# EAGLE design MEMS-preamp_v14 (EAGLE 8.5.0)

## Sheet 1 of 2
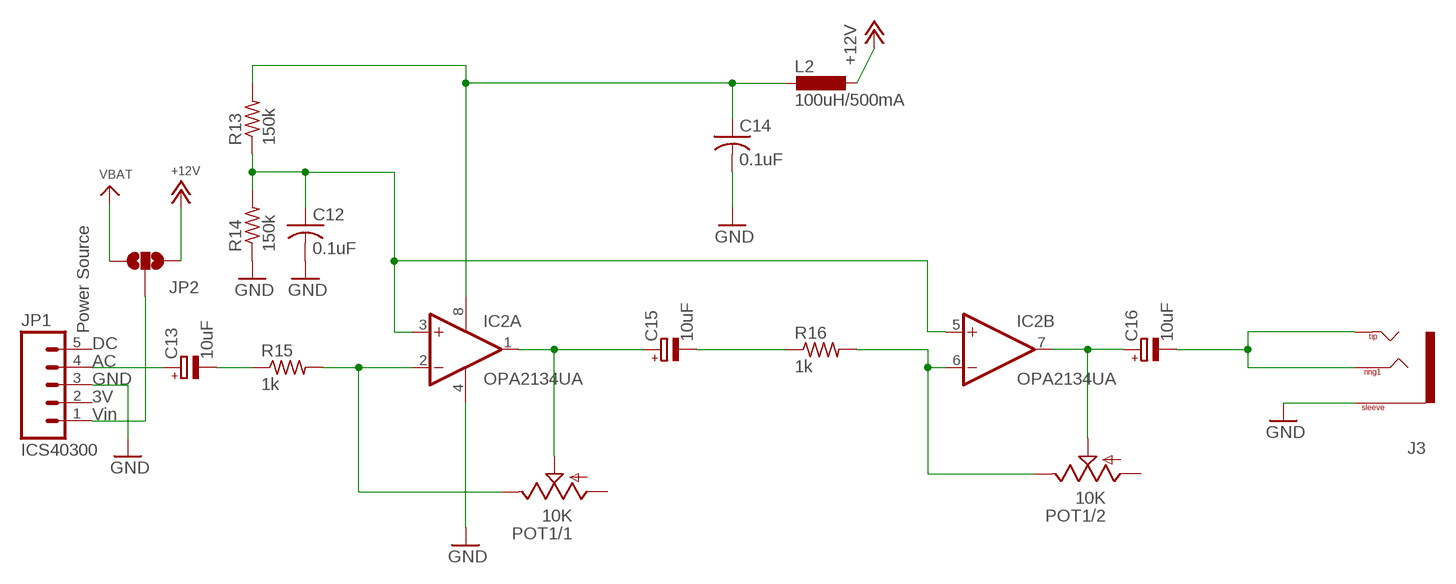
[diagram p0: schematic, sheet 1]

### Parts
C12  0.1uF  C-USC0805  [C0805]
C13  10uF  CPOL-EUB  [PANASONIC_B]
C14  0.1uF  C-USC0805K  [C0805K]
C15  10uF  CPOL-EUB  [PANASONIC_B]
C16  10uF  CPOL-EUB  [PANASONIC_B]
IC2  OPA2134UA  [SO08]
J3  TRS-1/8"-3.5MM  [TRS_SJ-3524-SMT]
JP1  ICS40300  M05SMD_2.54MM  [1X05_SMD_STRAIGHT]
JP2  Power Source  JUMPER-SMT_3_NO_SILK  [SMT-JUMPER_3_NO_SILK]
L2  100uH/500mA  L-EUL3225M  [L3225M]
POT1  10K  POT-DUAL-PTV112-4420  [PTV112]
R13  150k  R-US_R0603  [R0603]
R14  150k  R-US_R0603  [R0603]
R15  1k  R-US_R0603  [R0603]
R16  1k  R-US_R0603  [R0603]

### Nets
+12V [audio]: JP2.3 L2.1 ; also sheet 2
GND [audio]: C12.2 C14.2 IC2.4(A:V-) J3.1(SLEEVE) JP1.3 R14.1 ; also sheet 2
N$3 [audio]: C13.+ JP1.4
N$4 [audio]: C15.- R16.1
N$5 [audio]: IC2.2(A:-IN) POT1.1.3(/1:E) R15.2
N$7 [audio]: C16.- J3.2(TIP) J3.3(RING1) J3.4(TIP)
N$8 [audio]: C12.1 IC2.3(A:+IN) IC2.5(B:+IN) R13.1 R14.2
N$9 [audio]: C15.+ IC2.1(A:OUT) POT1.1.2(/1:S)
N$10 [audio]: C16.+ IC2.7(B:OUT) POT1.2.2(/2:S)
N$15 [audio]: C14.1 IC2.8(A:V+) L2.2 R13.2
N$21 [audio]: IC2.6(B:-IN) POT1.2.3(/2:E) R16.2
N$23 [audio]: C13.- R15.1
VBAT [audio]: JP2.1 ; also sheet 2
VIN [audio]: JP1.1 JP2.2
Unconnected: JP1.2 JP1.5 POT1.1.1(/1:A) POT1.2.1(/2:A)

## Sheet 2 of 2
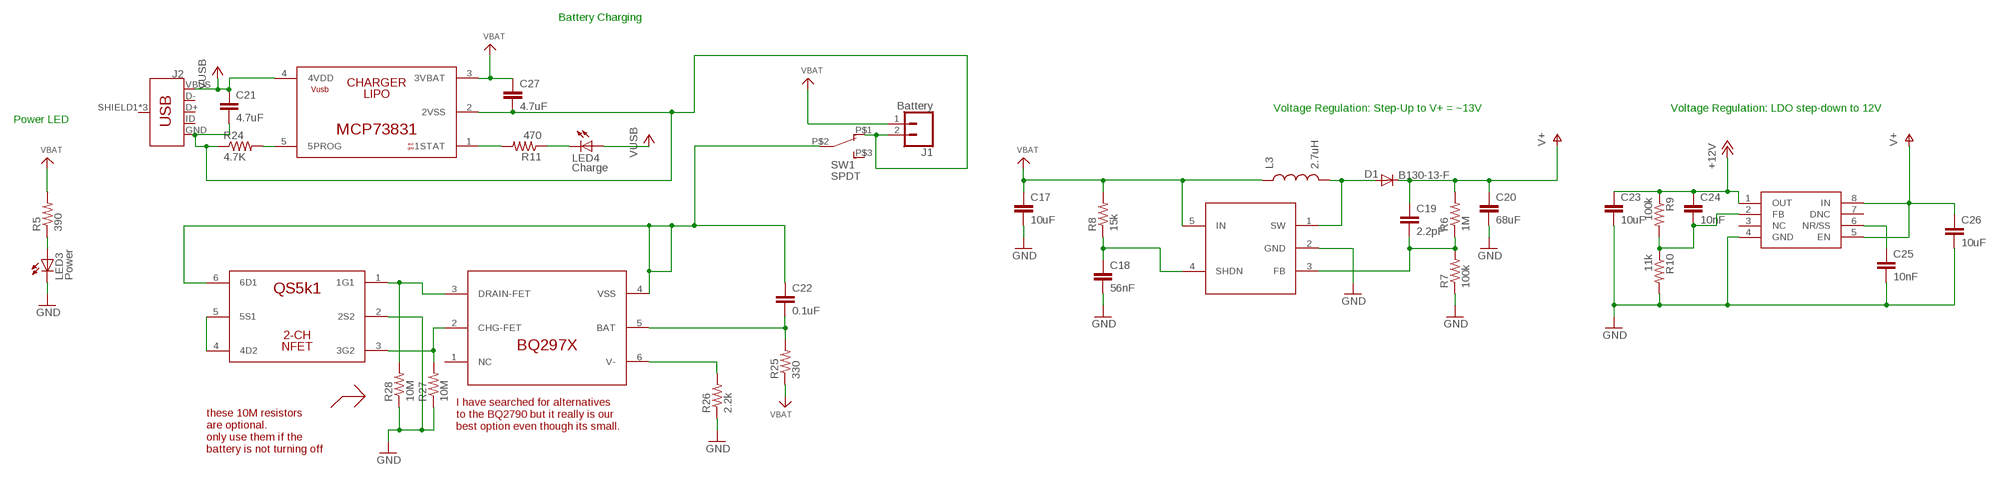
[diagram p1: schematic, sheet 2]

### Parts
C17  10uF  C-EUC0603  [C0603]
C18  56nF  C-EUC0603  [C0603]
C19  2.2pF  C-EUC0603  [C0603]
C20  68uF  C-EUC1206  [C1206]
C21  4.7uF  C-EUC0603  [C0603]
C22  0.1uF  C-EUC0603  [C0603]
C23  10uF  C-EUC0603  [C0603]
C24  10nF  C-EUC0603  [C0603]
C25  10nF  C-EUC0603  [C0603]
C26  10uF  C-EUC0603  [C0603]
C27  4.7uF  C-EUC0603  [C0603]
D1  B130-13-F  DIODESMA  [SMA-DIODE]
IC7  TPS7A49  [MSOP-8]
IC8  BQ297X  BQ297X-BATTERY-MANAGERLONG  [WSON-6-LONG]
IC9  SC4503  [SOT23-5]
IC10  MCP73831  [SOT-23-5]
IC11  QS6K1  [SOT457R_PHILIPS]
J1  Battery  CONN_02LOCK  [1X02_LOCK]
J2  USB_MICRO-BREDUCED_PASTE  [USB-B-MICRO-SMD_RED_PASTE]
L3  2.7uH  INDUCTORCR54  [CR54]
LED3  Power  LED3MM  [LED3MM]
LED4  Charge  LED3MM  [LED3MM]
R5  390  R-US_R0603  [R0603]
R6  1M  R-US_R0603  [R0603]
R7  100k  R-US_R0603  [R0603]
R8  15k  R-US_R0603  [R0603]
R9  100k  R-US_R0603  [R0603]
R10  11k  R-US_R0603  [R0603]
R11  470  R-US_R0603  [R0603]
R24  4.7K  R-US_R0603  [R0603]
R25  330  R-US_R0603  [R0603]
R26  2.2k  R-US_R0603  [R0603]
R27  10M  R-US_R0603  [R0603]
R28  10M  R-US_R0603  [R0603]
SW1  SPDT  SWITCH_SPDTCL-SB-12B  [SWITCH_SPDT_CL-SB-12B]

### Nets
+5V: C21.1 IC10.4(4VDD) J2.VBUS LED4.A ; supply symbol labelled VUSB
+12V [audio]: C23.1 C24.1 IC7.1(OUT) R9.1 ; also sheet 1
BATGND1: C22.1 IC8.4(VSS) IC11.6(6D1) SW1.P$2
GND [audio]: C17.2 C18.2 C20.2 C23.2 C25.2 C26.2 IC7.4(GND) IC9.2(GND) IC11.2(2S2) LED3.K(C) R7.1 R10.2 R26.1 R27.1 R28.1 ; also sheet 1
N$6: LED3.A R5.1
N$11: D1.A IC9.1(SW) L3.P$2
N$12: C18.1 IC9.4(SHDN) R8.1
N$13: C19.2 IC9.3(FB) R6.1 R7.2
N$14: C24.2 IC7.2(FB) R9.2 R10.1
N$16: C25.1 IC7.6(NR/SS)
N$17: LED4.K(C) R11.1
N$19: C22.2 IC8.5(BAT) R25.2
N$20: IC10.5(5PROG) R24.2
N$24: IC10.1(1STAT) R11.2
N$33: IC11.4(4D2) IC11.5(5S1)
N$35: IC8.3(DRAIN-FET) IC11.1(1G1) R28.2
N$36: IC8.2(CHG-FET) IC11.3(3G2) R27.2
N$37: IC8.6(V-) R26.2
USBGND1: C21.2 C27.2 IC10.2(2VSS) J1.2 J2.GND R24.1 SW1.P$1
V+: C19.1 C20.1 C26.1 D1.C IC7.5(EN) IC7.8(IN) R6.2
VBAT [audio]: C17.1 C27.1 IC9.5(IN) IC10.3(3VBAT) J1.1 L3.P$1 R5.2 R8.2 R25.1 ; also sheet 1
Unconnected: IC7.3(NC) IC7.7(DNC) IC8.1(NC) J2.D+ J2.D- J2.ID J2.SHIELD1(SHIELD) J2.SHIELD2(SHIELD) J2.SHIELD3(SHIELD) SW1.P$3

### Notes on the sheet
- Battery Charging
- Voltage Regulation: Step-Up to V+ = ~13V | Voltage Regulation: LDO step-down to 12V
- Power LED
- I have searched for alternatives 
  to the BQ2790 but it really is our 
  best option even though its small.
- these 10M resistors
  are optional. 
  only use them if the 
  battery is not turning off

## Library data of the parts
C12 C14 = adafruit:C-US: CAPACITOR, American symbol
C13 C15 C16 = CMU-ArtFab:CPOL-EU: POLARIZED CAPACITOR, European symbol
C17-C27 = rcl:C-EU: CAPACITOR, European symbol; SPICEPREFIX: C
D1 = SparkFun:DIODE: Diode These are standard reverse protection diodes and small signal diodes. SMA package can handle up to about 1A. SOD-323 can handle about 200mA. What the SOD-323 package when ordering, there are some mfgs out there that are 5-pin packages.
IC2 = linear:OPA2*: Dual Operational Amplifier Low Power, Single-Supply, Rail-To-Rail Operational Amplifier Source: http://focus.ti.com/lit/ds/symlink/opa2345.pdf http://focus.ti.com .. opa241.pdf http://focus.ti.com/lit/ds/symlink/opa2134.pdf
IC7 = CMU-ArtFab:TPS7A49
IC8 = CMU-ArtFab:BQ297X-BATTERY-MANAGER
IC9 = CMU-ArtFab:SC4503
IC10 = CMU-ArtFab:MCP73831
IC11 = CMU-ArtFab:QS6K1
J1 = SparkFun-Connectors:CONN_02: Multi connection point. Often used as Generic Header-pin footprint for 0.1 inch spaced/style header connections On any of the 0.1 inch spaced packages, you can populate with these: Break Away Headers - Straight <https://www.sparkfun.com/products/116> (PRT-00116) Break Away Male Headers - Right Angle <https://www.sparkfun.com/products/553> (PRT-00553) Female Headers <https://www.sparkfun.com/products/115> (PRT-00115) Break Away Headers - Machine Pin <https://www.sparkfun.com/products/117> (PRT-00117) Break Away Female Headers - Swiss Machine Pin <https://www.sparkfun.com/products/743> (PRT-00743) For SCREWTERMINALS and SPRING TERMINALS visit here: Screw Terimnals on SparkFun.com <https://www.sparkfun.com/search/results?term=Screw+Terminals> (5mm/3.5mm/2.54mm spacing) This device is also useful as a general connection point to wire up your design to another part of your project. Our various solder wires solder well into these plated through hole pads. Hook-Up Wire - Assortment (Stranded, 22 AWG) <https://www.sparkfun.com/products/11375> (PRT-11375) Hook-Up Wire - Assortment (Solid Core, 22 AWG) <https://www.sparkfun.com/products/11367> (PRT-11367) View the entire wire category on our website here <https://www.sparkfun.com/categories/141> Special notes: Molex polarized connector foot print use with: PRT-08233 with associated crimp pins and housings. 2.54_SCREWTERM for use with PRT-10571. 3.5mm Screw Terminal footprints for PRT-08084 5mm Screw Terminal footprints for use with PRT-08432
J2 = CMU-ArtFab:USB_MICRO-B: USB Type Micro-B Connector Male/female and PTH/SMT variants SparkFun Products: SparkFun microB USB Breakout <https://www.sparkfun.com/products/12035> SparkFun USB microB Plug Breakout <https://www.sparkfun.com/products/10031> SparkFun ESP8266 Thing <https://www.sparkfun.com/products/13231>; PROD_ID: CONN-11752
J3 = CMU-ArtFab:TRS-1/8"-3.5MM
JP1 = CMU-ArtFab:M05: Multi connection point. Often used as Generic Header-pin footprint for 0.1 inch spaced/style header connections On any of the 0.1 inch spaced packages, you can populate with these: Break Away Headers - Straight <https://www.sparkfun.com/products/116> (PRT-00116) Break Away Male Headers - Right Angle <https://www.sparkfun.com/products/553> (PRT-00553) Female Headers <https://www.sparkfun.com/products/115> (PRT-00115) Break Away Headers - Machine Pin <https://www.sparkfun.com/products/117> (PRT-00117) Break Away Female Headers - Swiss Machine Pin <https://www.sparkfun.com/products/743> (PRT-00743) For SCREWTERMINALS and SPRING TERMINALS visit here: Screw Terimnals on SparkFun.com <https://www.sparkfun.com/search/results?term=Screw+Terminals> (5mm/3.5mm/2.54mm spacing) This device is also useful as a general connection point to wire up your design to another part of your project. Our various solder wires solder well into these plated through hole pads. Hook-Up Wire - Assortment (Stranded, 22 AWG) <https://www.sparkfun.com/products/11375> (PRT-11375) Hook-Up Wire - Assortment (Solid Core, 22 AWG) <https://www.sparkfun.com/products/11367> (PRT-11367) View the entire wire category on our website here <https://www.sparkfun.com/categories/141> Special notes: Molex polarized connector foot print use with SKU : PRT-08231 with associated crimp pins and housings. 1MM SMD Version SKU: PRT-10208; CON1: Vin; CON2: 3V; CON3: GND; CON4: AC; CON5: DC
JP2 = SparkFun-Jumpers:JUMPER-SMT_3_NO: Normally open jumper This jumper has three pads in close proximity to each other. Apply solder to close the connection(s).
L2 = rcl:L-EU: INDUCTOR, European symbol; SPICEPREFIX: L
L3 = SparkFun-Passives:INDUCTOR: Inductors Basic Inductor/Choke - 0603 and 1206. Footprints are not proven and vary greatly between part numbers. SRN6045- 33uH, 20% 1.4A SDR0403-560KL - 56uH, 10%, 500mA RMS/740mA peak
LED3 LED4 = led:LED: LED OSRAM: - CHIPLED LG R971, LG N971, LY N971, LG Q971, LY Q971, LO R971, LY R971 LH N974, LH R974 LS Q976, LO Q976, LY Q976 LO Q996 - Hyper CHIPLED LW Q18S LB Q993, LB Q99A, LB R99A - SideLED LS A670, LO A670, LY A670, LG A670, LP A670 LB A673, LV A673, LT A673, LW A673 LH A674 LY A675 LS A676, LA A676, LO A676, LY A676, LW A676 LS A679, LY A679, LG A679 - Hyper Micro SIDELED® LS Y876, LA Y876, LO Y876, LY Y876 LT Y87S - SmartLED LW L88C, LW L88S LB L89C, LB L89S, LG L890 LS L89K, LO L89K, LY L89K LS L896, LA L896, LO L896, LY L896 - TOPLED LS T670, LO T670, LY T670, LG T670, LP T670 LSG T670, LSP T670, LSY T670, LOP T670, LYG T670 LG T671, LOG T671, LSG T671 LB T673, LV T673, LT T673, LW T673 LH T674 LS T676, LA T676, LO T676, LY T676, LB T676, LH T676, LSB T676, LW T676 LB T67C, LV T67C, LT T67C, LS T67K, LO T67K, LY T67K, LW E67C LS E67B, LA E67B, LO E67B, LY E67B, LB E67C, LV E67C, LT E67C LW T67C LS T679, LY T679, LG T679 LS T770, LO T770, LY T770, LG T770, LP T770 LB T773, LV T773, LT T773, LW T773 LH T774 LS E675, LA E675, LY E675, LS T675 LS T776, LA T776, LO T776, LY T776, LB T776 LHGB T686 LT T68C, LB T68C - Hyper Mini TOPLED® LB M676 - Mini TOPLED Santana® LG M470 LS M47K, LO M47K, LY M47K Source: http://www.osram.convergy.de LUXEON: - LUMILED® LXK2-PW12-R00, LXK2-PW12-S00, LXK2-PW14-U00, LXK2-PW14-V00 LXK2-PM12-R00, LXK2-PM12-S00, LXK2-PM14-U00 LXK2-PE12-Q00, LXK2-PE12-R00, LXK2-PE12-S00, LXK2-PE14-T00, LXK2-PE14-U00 LXK2-PB12-K00, LXK2-PB12-L00, LXK2-PB12-M00, LXK2-PB14-N00, LXK2-PB14-P00, LXK2-PB14-Q00 LXK2-PR12-L00, LXK2-PR12-M00, LXK2-PR14-Q00, LXK2-PR14-R00 LXK2-PD12-Q00, LXK2-PD12-R00, LXK2-PD12-S00 LXK2-PH12-R00, LXK2-PH12-S00 LXK2-PL12-P00, LXK2-PL12-Q00, LXK2-PL12-R00 Source: www.luxeon.com KINGBRIGHT: KA-3528ASYC Source: www.kingbright.com
POT1 = CMU-ArtFab:POT-DUAL-PTV112: Bourns 11mm dual potentiometer; AVAILABILITY: Unavailable; DESCRIPTION: Alt# Tce-10111410; MF: STMicroelectronics; MP: PTV112; PACKAGE: None; PRICE: None
R5-R11 R13-R16 R24-R28 = CMU-ArtFab:R-US_: RESISTOR, American symbol
SW1 = CMU-ArtFab:SWITCH_SPDT

## Net classes
0 default: width 0.305 mm
1 audio: width 0.508 mm

## Board
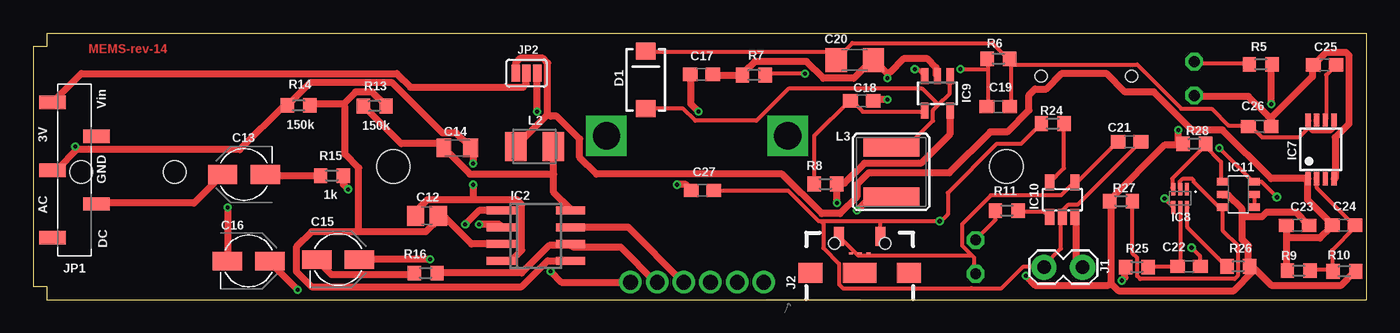
[diagram p2: board, top side]
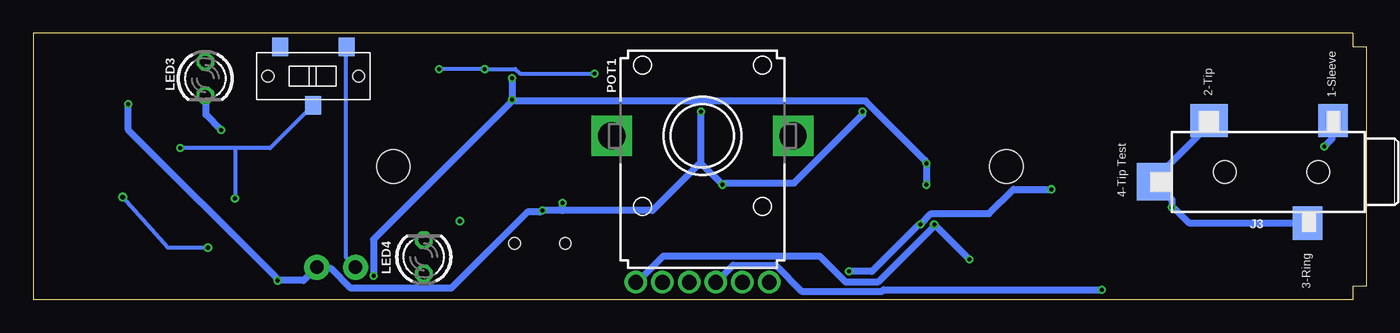
[diagram p3: board, bottom side, seen from below]

Size 100 x 20 mm. Coordinates in mm from the lower left corner, seen from the top.
Outline: 0,19 0,1 1.02,1 1,0 100,0 100,20 1,20 1,19 0,19
Copper layers (1*16): Top 0.035mm / dielectric 1.5mm / Bottom 0.035mm
Design rules "SeeedStudio_2layer_DRU_no_angle_20140221": minimum track width 6mil, minimum drill 12mil, track to track 6mil, track to pad 6mil, pad to pad 6mil, via to via 6mil, smd to smd 0mil, copper to edge 10mil, drill to drill 10mil, minimum pad ring 10mil, minimum via ring 6mil, stop-mask expansion 2mil, vias tented up to drill 100mil, thermal gap 10mil
Holes 2.5 mm at 73,10 27,10

### Footprints (pad centres in the part's own frame; a part is rotated, then mirrored left to right if it is on the bottom)
C0805 = smd 1.3 x 1.5: 1 -0.85,0; 2 0.85,0
PANASONIC_B = smd 2.2 x 1.4: + 1.6,0; - -1.6,0
C0805K = smd 1.1 x 1.4: 1 -1,0; 2 1,0
C0603 = smd 1.1 x 1: 1 -0.85,0; 2 0.85,0
C1206 = smd 1.6 x 1.8: 1 -1.4,0; 2 1.4,0
SMA-DIODE = smd 1.27 x 1.47: A -2.15,0; C 2.15,0
SO08 = smd 0.6 x 2.2: 1 -1.905,-2.6; 2 -0.635,-2.6; 3 0.635,-2.6; 4 1.905,-2.6; 5 1.905,2.6; 6 0.635,2.6; 7 -0.635,2.6; 8 -1.905,2.6
MSOP-8 = smd 0.4 x 1: 1 -0.975,-2.2; 2 -0.325,-2.2; 3 0.325,-2.2; 4 0.975,-2.2; 5 0.975,2.2; 6 0.325,2.2; 7 -0.325,2.2; 8 -0.975,2.2
WSON-6-LONG = smd 0.3 x 0.954: 1 -0.5,-0.686; 2 0,-0.686; 3 0.5,-0.686; 4 0.5,0.686; 5 0,0.686; 6 -0.5,0.686
SOT23-5 = smd 0.55 x 1.2: 1 -0.95,-1.3; 2 0,-1.3; 3 0.95,-1.3; 4 0.95,1.3; 5 -0.95,1.3
SOT-23-5 = smd 0.69 x 1.2: 1 -0.95,-1.3; 2 0,-1.3; 3 0.95,-1.3; 4 0.95,1.3; 5 -0.95,1.3
SOT457R_PHILIPS = smd 0.55 x 0.8: 1 -0.95,-1.2; 2 0,-1.2; 3 0.95,-1.2; 4 0.95,1.2; 5 0,1.2; 6 -0.95,1.2
1X02_LOCK = drill 1.016 pad 1.88: 1 -0.178,0; 2 2.718,0
USB-B-MICRO-SMD_RED_PASTE = smd 0.152 x 0.305: D+ 1.455,0; D- 1.455,0.65; ID 1.455,-0.65 | smd 1.45 x 0.762: GND 2.725,-1.554 | smd 1.5 x 1.8: SHIELD1 0,3.685; SHIELD2 0,-3.685 | smd 1.5 x 2.5: SHIELD3 0,0 | smd 1.45 x 0.781: VBUS 2.725,1.554 | hole 0.85: 2.2,1.9; 2.2,-1.9
TRS_SJ-3524-SMT = smd 2.5 x 2.2: 1 3.85,-4.6; 3 -3.85,-2.7 | smd 2.5 x 2.8: 2 3.85,4.7 | smd 2.8 x 2.5: 4 -0.75,8.85 | hole 1.7: 0,-3.5; 0,3.5
1X05_SMD_STRAIGHT = smd 1 x 2: 1 0,1.65; 2 -2.54,-1.65; 3 -5.08,1.65; 4 -7.62,-1.65; 5 -10.16,1.65
SMT-JUMPER_3_NO_SILK = smd 0.635 x 1.27: 1 -0.813,0; 2 0,0; 3 0.813,0
L3225M = smd 1.6 x 2.2: 1 -1.4,0; 2 1.4,0
CR54 = smd 4.2 x 1.4: P$1 0,1.85; P$2 0,-1.85
LED3MM = drill 0.813 octagon: A -1.27,0; K 1.27,0
PTV112 = drill 1.1 pad 1.676: 1.1 -3,-11; 1.2 -5,-11; 1.3 5,-11; 2.1 -1,-11; 2.2 1,-11; 2.3 3,-11 | drill 2.032 pad 2.8 square: M1 -6.8,0; M2 6.8,0
R0603 = smd 1 x 1.1: 1 -0.85,0; 2 0.85,0
SWITCH_SPDT_CL-SB-12B = smd 1.2 x 1.4: P$1 -2.5,-2.2; P$2 0,2.2; P$3 2.5,-2.2 | hole 0.9: -3.4,0; 3.4,0

### Placement (x,y rotation side)
C12  29.53,6.3 180 top
C13  15.8,9.4 180 top
C14  31.8,11.4 0 top
C15  22.87,3.01 0 top
C16  16.16,2.9 0 top
C17  50.13,16.91 0 top
C18  62.16,14.92 0 top
C19  72.39,14.49 180 top
C20  61.63,18 0 top
C21  82.24,11.84 0 top
C22  86.7,2.5 180 top
C23  94.85,5.57 0 top
C24  98.31,5.58 0 top
C25  96.88,17.62 180 top
C26  92,13 0 top
C27  50.2,8.2 0 top
D1  45.94,16.5 90 top
IC2  37.7,4.8 270 top
IC7  96.61,11.28 0 top
IC8  86.05,7.61 180 top
IC9  67.83,15.48 180 top
IC10  77.2,7.5 0 top
IC11  90.4,7.9 270 top
J1  78.55,2.44 180 top
J2  62,2.02 90 top
J3  7.1,9.6 90 bottom
JP1  3.09,14.8 90 top
JP2  37,17 180 top
L2  37.6,11.5 0 top
L3  64.37,9.59 180 top
LED3  87.1,16.6 270 bottom
LED4  70.7,3.2 90 bottom
POT1  49.8,12.3 0 bottom
R5  92.08,17.67 0 top
R6  72.41,18.09 0 top
R7  54.05,16.86 0 top
R8  59.43,8.68 0 top
R9  94.94,2.17 0 top
R10  98.37,2.12 0 top
R11  73.04,6.68 0 top
R13  25.61,14.54 180 top
R14  19.91,14.59 0 top
R15  22.4,9.31 0 top
R16  29.44,2 0 top
R24  76.48,13.21 0 top
R25  82.79,2.44 0 top
R26  90.4,2.5 180 top
R27  81.6,7.4 0 top
R28  87.1,11.7 0 top
SW1  79,16.78 180 bottom

### Tracks (layer width: path | path; a pad name or v marks a point on that pad's centre or on a via)
+5V
  Top 0.305: C21.1 81.33,11.83 78.24,8.74 IC10.4 78.02,8.74 77.1,7.83 71.84,7.83 69.67,5.66 69.67,4.05 70.41,3.31 | 70.41,3.31 70.59,3.14 70.59,2 LED4.A | J2.VBUS 61.88,3.31 70.41,3.31
+12V
  Top 0.508: 38.58,13.88 38.58,17.77 38.24,18.11 36.52,18.11 36.18,17.77 36.18,17.09 JP2.3 | 38.58,13.88 36.3,11.6 L2.1 | 94.02,4.63 94.02,5.54 C23.1 | 94.02,4.63 94.02,2.23 R9.1 | 95.62,8.97 95.62,7.48 97.45,5.66 C24.1 97.33,5.43 96.53,4.63 94.02,4.63 | 95.62,8.97 IC7.1 | 38.58,13.88 38.81,13.77 39.27,13.77 40.98,12.06 40.98,10.68 42.24,9.43 56.18,9.43 59.16,6.46 60.53,6.46 61.79,7.71 61.79,8.63 62.7,9.54 68.74,9.54 71.8,12.6 73.07,12.6 74.7,14.23 74.7,15.37 75.15,15.82 76,15.82 77.18,17 80.5,17 81.9,15.6 84.07,15.6 86.93,12.74 89.22,12.74 92.87,9.09 95.39,9.09 95.62,8.97
BATGND1  (via drill 0.3, 0.35)
  Top 0.305: 85.56,6.91 IC8.4 85.45,7.03 v84.87,7.6 | 87.5,2.57 C22.1 87.55,3.25 v86.9,3.9 | v88.99,11.37 91.5,8.86 IC11.6 92.15,8.85 v93.3,7.7
  Bottom 0.305: 84.87,11.37 82.24,11.37 79.04,14.57 SW1.P$2 | 84.87,11.37 v88.99,11.37 | 84.87,11.37 v84.87,7.6 | v86.9,3.9 89.9,3.9 v93.3,7.7 93.4,7.7
GND  (via drill 0.3)
  Top 0.508: IC7.4 97.68,9.09 97.68,12.17 98.7,13.2 98.7,18.34 98.48,18.57 96.99,18.57 96.08,17.66 C25.2 95.96,17.43 95.96,16.74 92.87,13.66 | 92.87,13.66 92.87,13.09 C26.2 | LED3.K 87.16,15.26 91.16,15.26 92.65,13.77 92.87,13.66 | 90.7,6.23 90.7,4.51 91.16,4.05 91.16,2.57 R26.1 | 90.7,6.23 90.7,6.8 89.67,7.83 89.22,7.83 IC11.2 | R10.2 99.16,2.11 98.13,1.08 92.87,1.08 91.5,2.46 R26.1 | 90.7,6.23 92.19,6.23 92.53,6.57 94.7,6.57 95.62,5.66 C23.2 | 80.87,1.2 80.87,7.26 R27.1 80.76,7.48 84.87,11.6 86.25,11.6 R28.1 85.9,11.83 v85.9,12.74 | 80.87,1.2 81.44,0.63 90.02,0.63 91.5,2.11 R26.1 | C17.2 51.04,16.86 53.1,16.86 R7.1 53.33,17.09 54.13,17.89 58.01,17.89 59.27,16.63 61.56,16.63 62.81,17.89 C20.2 63.04,18 64.07,16.97 | v64.07,15.03 63.04,15.03 C18.2 | 64.07,16.97 v64.07,16.63 | IC9.2 67.73,16.86 67.73,17.43 67.04,18.11 65.33,18.11 64.3,17.09 64.07,16.97 | 32.98,7.48 36.3,7.48 36.64,7.14 36.64,3.71 35.84,2.91 35.15,2.91 IC2.4 | 32.98,7.48 29.55,7.48 28.75,6.68 28.75,6.34 C12.2 | 3.26,11.26 1.78,9.77 1.55,9.77 JP1.3 | 3.26,11.26 15.49,11.26 18.81,14.57 R14.1 19.15,14.69 20.75,16.29 26.92,16.29 30.7,12.51 31.72,12.51 32.75,11.48 C14.2 32.98,11.26 v32.98,10.23 | v3.15,11.48 3.26,11.26 | v32.98,8.63 32.98,7.48 | v74.47,1.77 75.16,1.08 80.64,1.08 80.87,1.2
  Bottom 0.508: v85.9,12.74 87.05,13.88 87.05,15.26 LED3.K | v64.07,16.63 v64.07,15.03 | v3.15,11.48 2.58,12.06 2.58,13.43 J3.1 | v32.98,8.63 v32.98,10.23 33.1,10.46 37.55,14.91 63.84,14.91 v64.07,15.03 | v74.47,1.77 74.47,4.51 64.19,14.8 v64.07,15.03
N$3
  Top 0.508: JP1.4 4.75,7.26 12.06,7.26 14.12,9.31 C13.+
N$4
  Top 0.508: R16.1 28.52,1.88 22.35,1.88 21.32,2.91 C15.-
N$5  (via drill 0.3)
  Top 0.508: v23.61,8.28 23.27,8.63 23.27,9.2 R15.2 | v33.44,5.66 34.92,5.66 35.04,5.54 IC2.2 | v38.81,2.11 39.61,1.31 44.75,1.31 POT1.1.3
  Bottom 0.508: v23.61,8.28 26.47,8.28 28.3,6.46 32.64,6.46 v33.44,5.66 33.67,5.54 37.1,2.11 v38.81,2.11
N$6
  Top 0.305: R5.1 91.16,17.77 87.16,17.77 LED3.A
N$7  (via drill 0.3)
  Top 0.508: v14.58,6.91 14.58,2.91 C16.-
  Bottom 0.508: J3.3 4.41,5.77 13.32,5.77 14.35,6.8 v14.58,6.91 14.58,7.48 15.84,8.74 J3.4 15.84,9.09 11.84,13.09 11.84,13.43 J3.2
N$8
  Top 0.508: 23.27,14.69 20.87,14.69 R14.2 | 23.27,14.69 24.18,15.6 25.44,15.6 26.47,14.57 R13.1 | IC2.3 35.04,4.17 32.87,4.17 30.81,6.23 30.47,6.23 C12.1 30.35,6 29.44,5.08 24.41,5.08 | 24.41,5.08 20.87,5.08 19.72,3.94 19.72,2.11 20.87,0.97 36.64,0.97 38.58,2.91 40.3,2.91 IC2.5 | 24.41,5.08 24.41,9.88 23.38,10.91 23.38,14.46 23.27,14.69
N$9  (via drill 0.3)
  Top 0.508: v29.78,3.03 24.52,3.03 C15.+ | v32.41,5.66 33.44,6.68 35.04,6.68 IC2.1
  Bottom 0.508: v29.78,3.03 v32.41,5.66 32.52,5.43 36.64,1.31 39.04,1.31 40.98,3.26 52.76,3.26 54.7,1.31 POT1.1.2
N$10  (via drill 0.3)
  Top 0.508: v19.84,0.74 17.78,2.8 C16.+ | IC2.7 40.41,5.43 44.64,5.43 48.76,1.31 POT1.2.2
  Bottom 0.508: v19.84,0.74 36.18,0.74 36.3,0.63 42.35,0.63 44.3,2.57 47.5,2.57 48.76,1.31 POT1.2.2
N$11
  Top 0.305: 67.9,14.63 67.5,14.23 67.5,13.43 65.56,11.48 64.41,11.48 L3.P$2 | 67.9,14.63 68.76,15.48 68.76,16.74 IC9.1 | 67.9,14.63 66.7,15.83 56.64,15.83 54.24,13.43 49.67,13.43 48.76,14.34 46.01,14.34 D1.A
N$12
  Top 0.305: R8.1 58.58,8.74 58.58,12.29 61.21,14.91 C18.1 61.44,14.91 62.24,14.11 66.81,14.11 IC9.4
N$13  (via drill 0.3)
  Top 0.305: 71.61,17.31 71.61,18 R6.1 | 71.61,17.31 71.61,14.57 C19.2 | v57.9,16.97 54.93,16.97 R7.2 | v66.13,17.31 66.36,17.31 66.81,16.86 IC9.3 | v69.56,17.31 71.61,17.31
  Bottom 0.305: v57.9,16.97 63.5,16.97 63.84,17.31 v66.13,17.31 v69.56,17.31
N$14
  Top 0.305: R9.2 95.85,2.23 97.45,2.23 R10.1 97.45,2.34 97.45,3.71 99.16,5.43 C24.2 99.05,5.66 96.3,8.4 96.3,8.97 IC7.2
N$15
  Top 0.508: 39.04,9.43 39.04,8.06 40.3,6.8 IC2.8 | 39.04,9.43 39.04,11.48 L2.2 | R13.2 24.87,14.46 27.61,11.71 30.47,11.71 30.7,11.48 C14.1 30.92,11.26 32.75,9.43 39.04,9.43
N$16
  Top 0.305: IC7.6 96.99,13.54 96.99,16.86 97.68,17.54 C25.1
N$17
  Top 0.305: R11.1 72.19,6.57 72.19,6 70.7,4.51 LED4.K
N$19
  Top 0.305: 85.6,2.46 85.79,2.46 C22.2 | 85.6,2.46 83.73,2.46 R25.2 | IC8.5 86.05,2.9 85.6,2.46
N$20
  Top 0.305: IC10.5 77.33,9.88 R24.2
N$21
  Top 0.508: R16.2 30.35,2 36.64,2 38.7,4.05 40.3,4.05 IC2.6 40.53,3.94 44.07,3.94 46.7,1.31 POT1.2.3
N$23
  Top 0.508: R15.1 21.44,9.31 17.44,9.31 C13.-
N$24
  Top 0.305: R11.2 73.9,6.57 75.84,6.57 76.19,6.23 IC10.1
N$33
  Top 0.305: IC11.4 91.62,7.03 91.62,7.83 IC11.5
N$35
  Top 0.305: IC11.1 89.1,8.86 89.1,10.34 87.84,11.6 R28.2 87.84,11.48 85.45,9.09 85.45,8.4 IC8.3
N$36
  Top 0.305: IC8.2 86.02,8.4 86.02,8.86 86.25,9.09 86.93,9.09 87.05,8.97 87.05,8.86 88.87,7.03 89.1,7.03 IC11.3 89.22,6.8 89.22,5.2 90.36,4.05 90.36,1.77 90.13,1.54 83.05,1.54 82.82,1.77 82.82,3.14 82.47,3.48 82.47,7.37 R27.2
N$37
  Top 0.305: IC8.6 86.59,6.91 86.59,5.43 89.45,2.57 R26.2
USBGND1  (via drill 0.35)
  Top 0.305: C21.2 83.05,11.83 78.36,7.14 77.67,7.14 77.22,6.68 77.22,6.23 IC10.2 77.1,6.11 77.1,3.83 75.84,2.57 J1.2 75.73,2.46 74.24,2.46 72.64,0.86 70.4,0.86 70.36,0.86 60.73,0.86 60.45,1.14 60.45,2.7 59.27,3.88 59.27,5.72 59.1,5.88 | 63.5,5.88 59.1,5.88 | 59.1,5.88 58.93,5.88 56.64,8.17 51.16,8.17 C27.2 | J2.GND 63.55,5.83 63.5,5.88 | 63.5,5.88 v68,5.88 68.08,5.88 68.6,6.4 68.6,8.01 72.3,11.71 74.12,11.71 R24.1
  Bottom 0.305: SW1.P$1 76.53,18.91 76.53,3.14 75.84,2.46 J1.2
V+
  Top 0.305: 95.73,12.86 95.73,13.43 IC7.8 | 95.73,12.86 95.96,12.63 97.33,12.63 97.56,12.86 97.56,13.43 IC7.5 | 95.73,12.86 95.62,12.86 94.93,12.17 92.19,12.17 91.39,12.97 91.16,12.97 C26.1 91.05,13.09 89.67,13.09 88.42,14.34 86.13,14.34 82.82,17.66 73.44,17.66 R6.2 | C19.1 73.33,14.57 73.33,18 R6.2 | D1.C 46.01,18.57 59.61,18.57 60.18,18 C20.1 60.3,18.11 61.44,19.26 71.96,19.26 72.99,18.23 73.22,18.23 R6.2
VBAT  (via drill 0.3)
  Top 0.508: v81.67,1.43 81.9,1.66 81.9,2.34 R25.1 | v92.87,14.69 92.87,17.66 R5.2 | IC10.3 78.24,6.11 78.24,2.91 78.7,2.46 J1.1 | IC9.5 68.76,14.11 68.76,12.4 66.59,10.23 62.36,10.23 60.87,8.74 60.3,8.74 R8.2 60.3,8.51 v60.3,7.26 | v49.9,14.11 49.33,14.69 49.33,16.86 C17.1 | v48.3,8.63 48.98,8.63 49.33,8.28 C27.1 | v37.78,14.11 37.78,16.97 JP2.1 | v61.79,6.68 62.81,7.71 64.3,7.71 L3.P$1
  Bottom 0.508: v92.87,14.69 92.87,12.74 81.79,1.66 v81.67,1.43 79.73,1.43 78.81,2.34 J1.1 78.47,2.34 77.67,2.34 76.19,0.86 68.64,0.86 62.93,6.57 62.01,6.57 v61.79,6.68 60.3,6.68 | 49.9,10.23 v49.9,14.11 | 49.9,10.23 v48.3,8.63 48.07,8.74 42.93,8.74 37.78,13.88 v37.78,14.11 | 60.3,6.68 53.56,6.68 50.13,10.11 49.9,10.23 | 60.3,6.68 v60.3,7.26
VIN
  Top 0.508: JP2.2 36.98,16.97 36.98,16.17 36.75,15.94 28.3,15.94 27.27,16.97 3.61,16.97 1.55,14.91 JP1.1

### Text on the board
Top: MEMS-rev-14